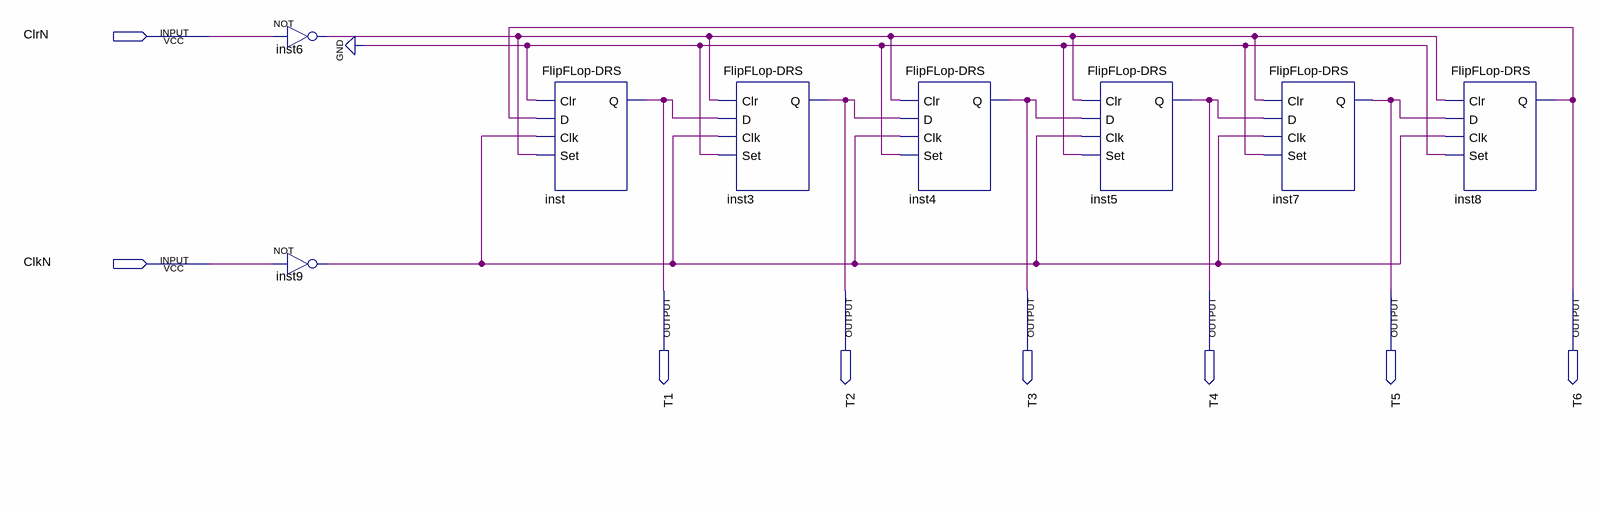
[diagram p0: schematic sheet]
// Quartus schematic Contador-Anel.bdf as structural Verilog: 8 symbols, 8 pins
module \Contador-Anel  (
  input  ClrN,
  input  ClkN,
  output T1,
  output T2,
  output T3,
  output T4,
  output T5,
  output T6
);

  wire inst6_out, inst9_out;

  not inst6 (inst6_out, ClrN);
  not inst9 (inst9_out, ClkN);
  \FlipFLop-DRS  inst (.Clr(1'b0), .D(T6), .Clk(inst9_out), .Set(inst6_out), .Q(T1));
  \FlipFLop-DRS  inst3 (.Clr(inst6_out), .D(T1), .Clk(inst9_out), .Set(1'b0), .Q(T2));
  \FlipFLop-DRS  inst4 (.Clr(inst6_out), .D(T2), .Clk(inst9_out), .Set(1'b0), .Q(T3));
  \FlipFLop-DRS  inst5 (.Clr(inst6_out), .D(T3), .Clk(inst9_out), .Set(1'b0), .Q(T4));
  \FlipFLop-DRS  inst7 (.Clr(inst6_out), .D(T4), .Clk(inst9_out), .Set(1'b0), .Q(T5));
  \FlipFLop-DRS  inst8 (.Clr(inst6_out), .D(T5), .Clk(inst9_out), .Set(1'b0), .Q(T6));
endmodule
